# EAGLE schematic Wiazka_Lewa_Rekojesc (EAGLE 8.6.0)
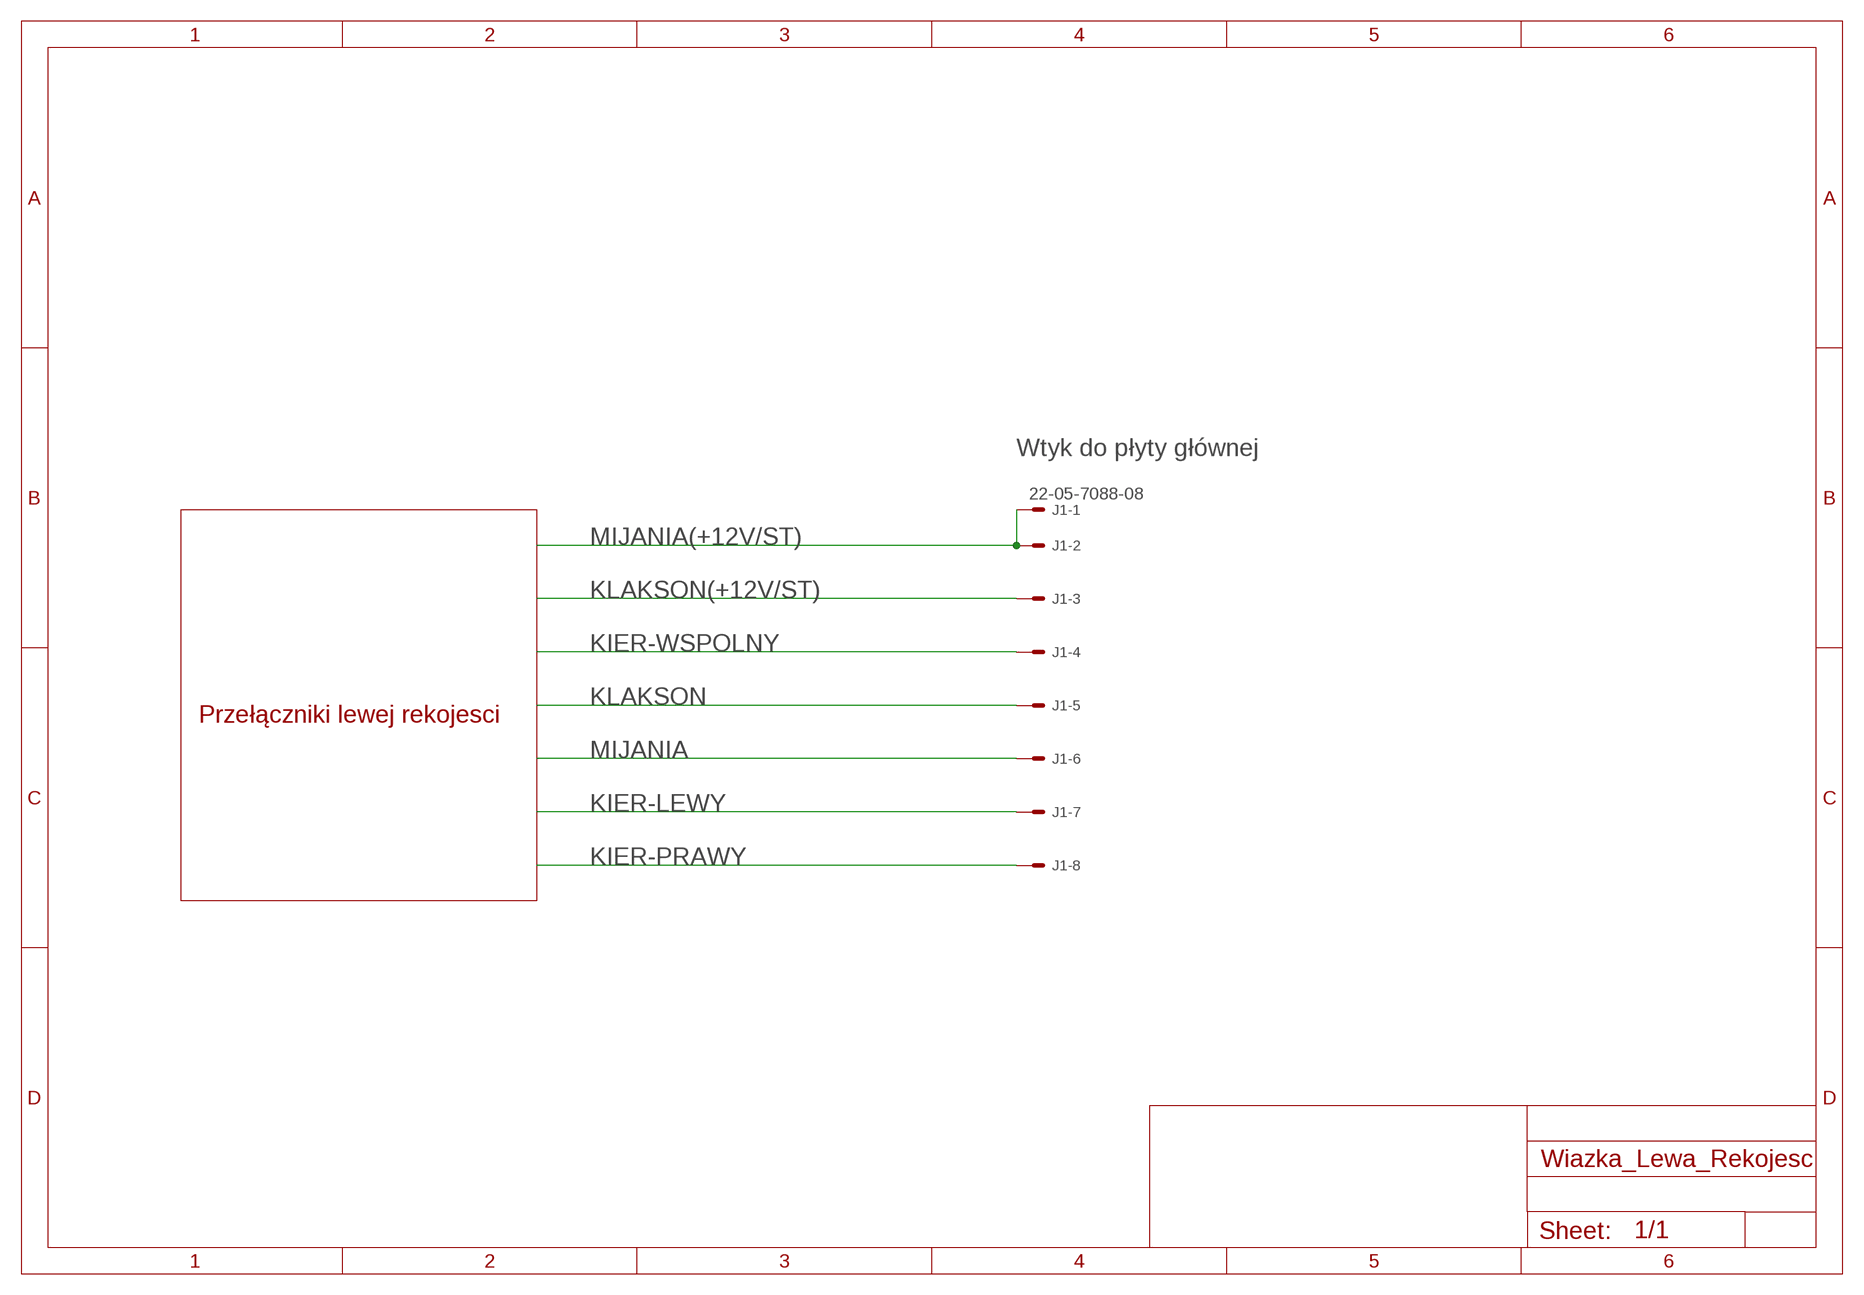
[diagram p0: schematic, sheet 1]

## Parts
J1  22-05-7088-08  [7395-08]

## Nets
KIER-LEWY: J1.7
KIER-PRAWY: J1.8
KIER-WSPOLNY: J1.4
KLAKSON: J1.5
KLAKSON(+12V/ST): J1.3
MIJANIA: J1.6
MIJANIA(+12V/ST): J1.1 J1.2

## Notes on the sheet
- Wtyk do płyty głównej
- Przełączniki lewej rekojesci

## Library data of the parts
J1 = con-molex:22-?-08: CONNECTOR wire to board 2.54 mm (.1 inch) pitch header; MF: MOLEX; OC_FARNELL: unknown; OC_NEWARK: unknown